# EAGLE design Interface (EAGLE 7.6.0)

## Sheet 1 of 3
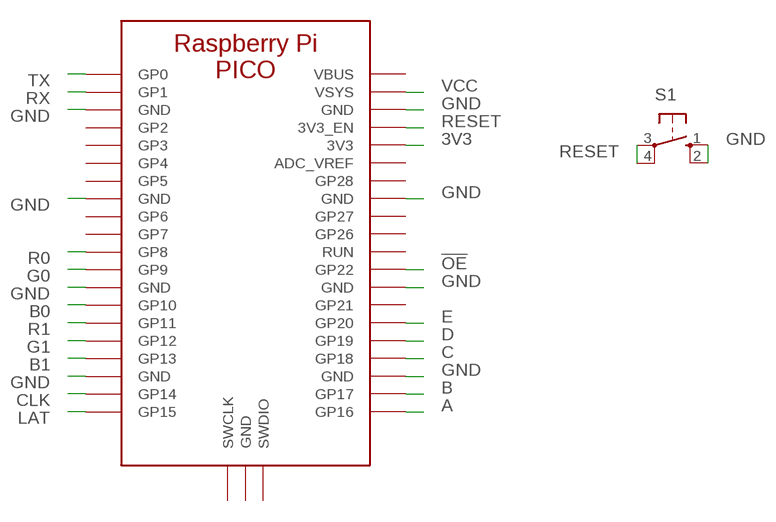
[diagram p0: schematic, sheet 1]

### Parts
S1  10-XX  [B3F-10XX]
U$1  PICO  [PICO]

### Nets
3V3: U$1.P$3V3(3V3) ; also sheet 2
!OE: U$1.P$GP22(GP22) ; also sheet 3
A: U$1.P$GP16(GP16) ; also sheet 3
B: U$1.P$GP17(GP17) ; also sheet 3
B0: U$1.P$GP10(GP10) ; also sheet 3
B1: U$1.P$GP13(GP13) ; also sheet 3
C: U$1.P$GP18(GP18) ; also sheet 3
CLK: U$1.P$GP14(GP14) ; also sheet 3
D: U$1.P$GP19(GP19) ; also sheet 3
E: U$1.P$GP20(GP20) ; also sheet 3
G0: U$1.P$GP9(GP9) ; also sheet 3
G1: U$1.P$GP12(GP12) ; also sheet 3
GND: S1.1(S) S1.2(S1) U$1.P$GND3(GND) U$1.P$GND8(GND) U$1.P$GND13(GND) U$1.P$GND18(GND) U$1.P$GND23(GND) U$1.P$GND28(GND) U$1.P$GND33(GND) U$1.P$GND38(GND) ; also sheet 2,3
LAT: U$1.P$GP15(GP15) ; also sheet 3
R0: U$1.P$GP8(GP8) ; also sheet 3
R1: U$1.P$GP11(GP11) ; also sheet 3
RESET: S1.3(P) S1.4(P1) U$1.P$3V3_EN(3V3_EN)
RX: U$1.P$GP1(GP1) ; also sheet 2
TX: U$1.P$GP0(GP0) ; also sheet 2
VCC: U$1.P$VSYNC(VSYS) ; also sheet 2
Unconnected: U$1.P$GP2(GP2) U$1.P$GP3(GP3) U$1.P$GP4(GP4) U$1.P$GP5(GP5) U$1.P$GP6(GP6) U$1.P$GP7(GP7) U$1.P$GP21(GP21) U$1.P$GP26(GP26) U$1.P$GP27(GP27) U$1.P$GP28(GP28) U$1.P$RUN(RUN) U$1.P$SWCLK(SWCLK) U$1.P$SWDIO(SWDIO)

## Sheet 2 of 3
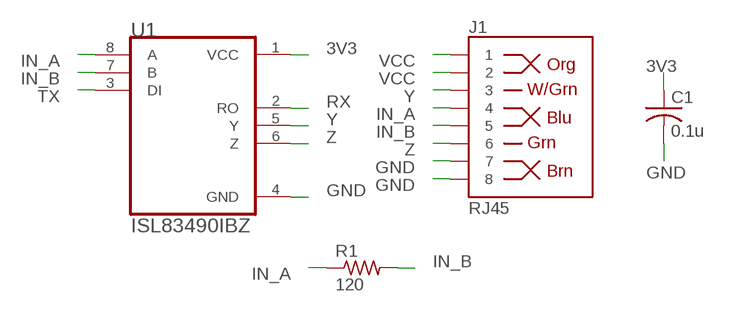
[diagram p1: schematic, sheet 2]

### Parts
C1  0.1u  C-USC0603  [C0603]
J1  RJ45  RJ45-8PTH  [RJ45-8]
R1  120  R-US_R0603  [R0603]
U1  ISL83490IBZ  [SOIC127P600X175-8N]

### Nets
3V3: C1.1 U1.1(VCC) ; also sheet 1
GND: C1.2 J1.7 J1.8 U1.4(GND) ; also sheet 1,3
IN_A: J1.4 R1.1 U1.8(A)
IN_B: J1.5 R1.2 U1.7(B)
RX: U1.2(RO) ; also sheet 1
TX: U1.3(DI) ; also sheet 1
VCC: J1.1 J1.2 ; also sheet 1
Y: J1.3 U1.5(Y)
Z: J1.6 U1.6(Z)

## Sheet 3 of 3
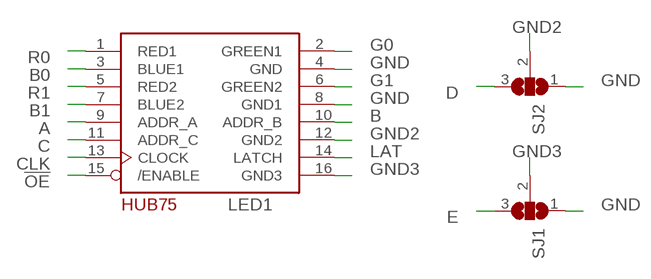
[diagram p2: schematic, sheet 3]

### Parts
LED1  HUB75MATRIX  [2X08-IDC]
SJ1  SJ2W  [SJ_2]
SJ2  SJ2W  [SJ_2]

### Nets
!OE: LED1.15(/ENABLE) ; also sheet 1
A: LED1.9(ADDR_A) ; also sheet 1
B: LED1.10(ADDR_B) ; also sheet 1
B0: LED1.3(BLUE1) ; also sheet 1
B1: LED1.7(BLUE2) ; also sheet 1
C: LED1.11(ADDR_C) ; also sheet 1
CLK: LED1.13(CLOCK) ; also sheet 1
D: SJ2.3 ; also sheet 1
E: SJ1.3 ; also sheet 1
G0: LED1.2(GREEN1) ; also sheet 1
G1: LED1.6(GREEN2) ; also sheet 1
GND: LED1.4(GND) LED1.8(GND1) SJ1.1 SJ2.1 ; also sheet 1,2
GND2: LED1.12(GND2) SJ2.2
GND3: LED1.16(GND3) SJ1.2
LAT: LED1.14(LATCH) ; also sheet 1
R0: LED1.1(RED1) ; also sheet 1
R1: LED1.5(RED2) ; also sheet 1

## Power pins joined to a net without a drawn wire
ADC_VREF: U$1.P$ADC_VREF(ADC_VREF)
GND: U$1.P$GND(GND)
VBUS: U$1.P$VBUS(VBUS)

## Library data of the parts
C1 = rcl:C-US: CAPACITOR, American symbol
J1 = SparkFun-Connectors:RJ45-8: RJ45 Jack Simple RJ45, 8-pin connection - connector for common Cat5, Cat5e, and Cat6 Ethernet cables. Footprint not yet proven in production. Connector sku is PRT-00643; Breakout PCB sku is BOB-00716.; PROD_ID: CONN-08506
LED1 = adafruit:HUB75MATRIX
R1 = rcl:R-US_: RESISTOR, American symbol
S1 = switch-omron:10-XX: OMRON SWITCH; MPN: B3F-1000; OC_FARNELL: 176432; OC_NEWARK: 36M3542
SJ1 SJ2 = jumper:SJ2W: SMD solder JUMPER
U1 = ISL83490IBZ:ISL83490IBZ: None; DESCRIPTION: ISL83490 Series 3.6 V 10 Mbps Low Power High Speed RS-485/RS-422 Transceiver; DIGI-KEY_PART_NUMBER: ISL83490IBZ-TCT-ND; DIGI-KEY_PURCHASE_URL: https://www.digikey.com/product-detail/en/renesas-electronics-america-inc/ISL83490IBZ-T/ISL83490IBZ-TCT-ND/3603227?utm_source=snapeda&utm_medium=aggregator&utm_campaign=symbol; MF: Renesas Electronics; MP: ISL83490IBZ-T; PACKAGE: SOIC-8 Intersil
U$1 = Raspberry_Pi_Pico:PICO

## Board
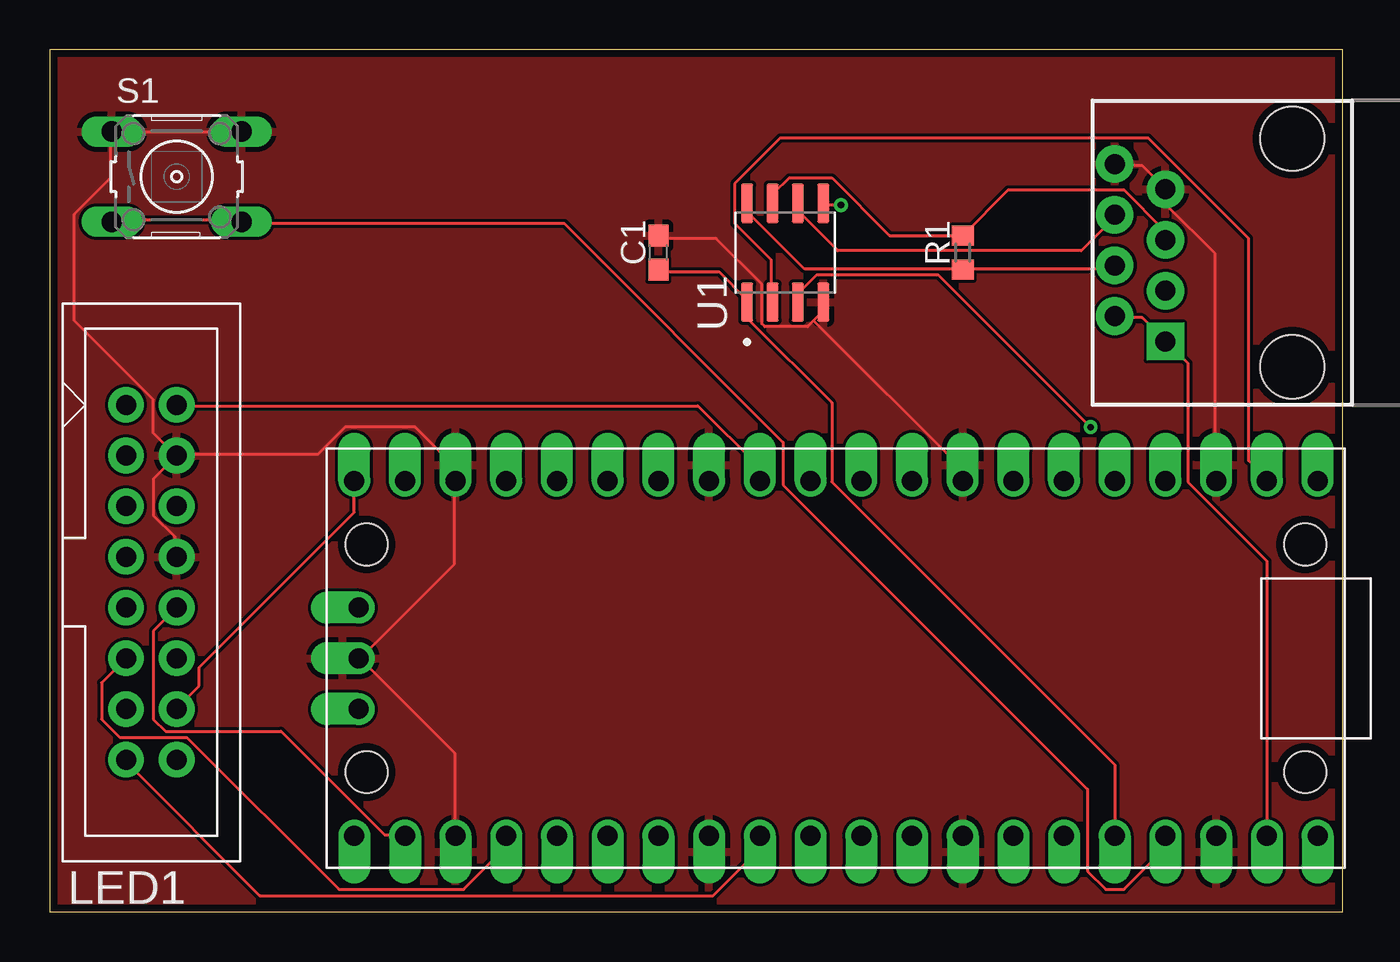
[diagram p3: board, top side]
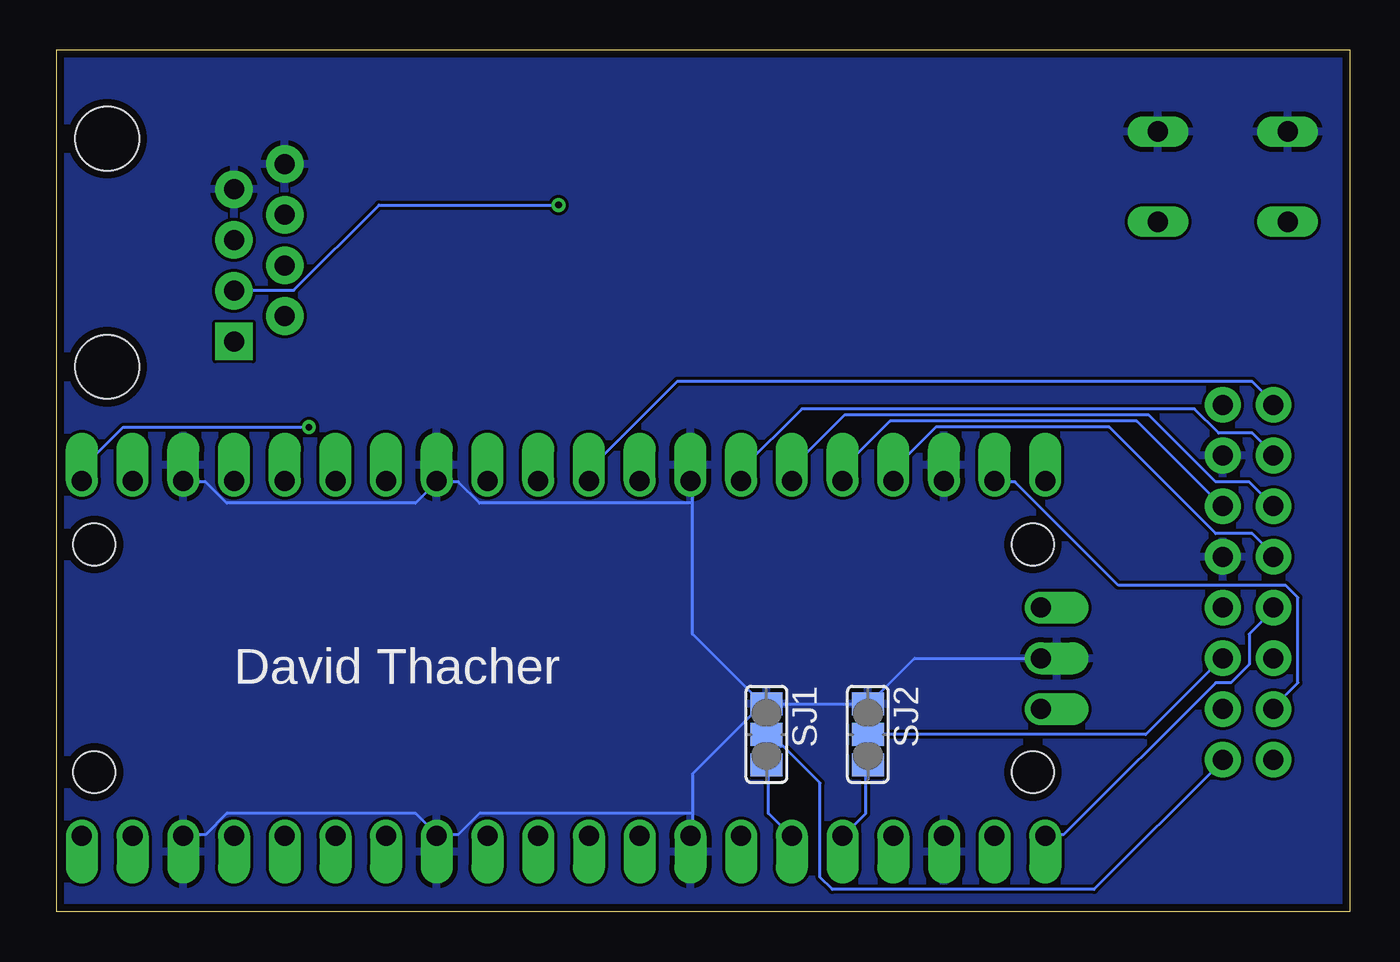
[diagram p4: board, bottom side, seen from below]

Size 64.77 x 43.18 mm. Coordinates in mm from the lower left corner, seen from the top.
Outline: 0,0 64.77,0 64.77,43.18 0,43.18 0,0
Copper layers (1*16): Top 0.0356mm / dielectric 1.5011mm / Bottom 0.0356mm
Design rules "oshpark-2layer": minimum track width 6mil, minimum drill 13mil, track to track 6mil, track to pad 6mil, pad to pad 6mil, via to via 6mil, smd to smd 6mil, copper to edge 15mil, drill to drill 6mil, minimum pad ring 7mil, minimum via ring 7mil, stop-mask expansion 2.5mil, vias tented up to drill 0mil, thermal gap 10mil

### Footprints (pad centres in the part's own frame; a part is rotated, then mirrored left to right if it is on the bottom)
C0603 = smd 1.1 x 1: 1 -0.85,0; 2 0.85,0
RJ45-8 = drill 1 pad 1.88 square: 1 -4.445,6.35 | drill 1 pad 1.88: 2 -3.175,8.89; 3 -1.905,6.35; 4 -0.635,8.89; 5 0.635,6.35; 6 1.905,8.89; 7 3.175,6.35; 8 4.445,8.89 | hole 3.2: -5.715,0; 5.715,0
2X08-IDC = drill 1 pad 1.778: 1 -1.27,8.89; 2 1.27,8.89; 3 -1.27,6.35; 4 1.27,6.35; 5 -1.27,3.81; 6 1.27,3.81; 7 -1.27,1.27; 8 1.27,1.27; 9 -1.27,-1.27; 10 1.27,-1.27; 11 -1.27,-3.81; 12 1.27,-3.81; 13 -1.27,-6.35; 14 1.27,-6.35; 15 -1.27,-8.89; 16 1.27,-8.89
R0603 = smd 1 x 1.1: 1 -0.85,0; 2 0.85,0
B3F-10XX = drill 1.016 long: 1 -3.251,2.261; 2 3.251,2.261; 3 -3.251,-2.261; 4 3.251,-2.261
SJ_2 = smd 1.168 x 1.6: 1 -1.524,0; 2 0,0; 3 1.524,0
SOIC127P600X175-8N = smd 1.97 x 0.6: 1 -2.475,1.905; 2 -2.475,0.635; 3 -2.475,-0.635; 4 -2.475,-1.905; 5 2.475,-1.905; 6 2.475,-0.635; 7 2.475,0.635; 8 2.475,1.905
PICO = drill 1 pad 1.6 offset: P$3V3 8.89,13.97; P$3V3_EN 8.89,16.51; P$ADC_VREF 8.89,11.43; P$GND 0,-23.9; P$GND3 -8.89,19.05; P$GND8 -8.89,6.35; P$GND13 -8.89,-6.35; P$GND18 -8.89,-19.05; P$GND23 8.89,-19.05; P$GND28 8.89,-6.35; P$GND33 8.89,6.35; P$GND38 8.89,19.05; P$GP0 -8.89,24.13; P$GP1 -8.89,21.59; P$GP2 -8.89,16.51; P$GP3 -8.89,13.97; P$GP4 -8.89,11.43; P$GP5 -8.89,8.89; P$GP6 -8.89,3.81; P$GP7 -8.89,1.27; P$GP8 -8.89,-1.27; P$GP9 -8.89,-3.81; P$GP10 -8.89,-8.89; P$GP11 -8.89,-11.43; P$GP12 -8.89,-13.97; P$GP13 -8.89,-16.51; P$GP14 -8.89,-21.59; P$GP15 -8.89,-24.13; P$GP16 8.89,-24.13; P$GP17 8.89,-21.59; P$GP18 8.89,-16.51; P$GP19 8.89,-13.97; P$GP20 8.89,-11.43; P$GP21 8.89,-8.89; P$GP22 8.89,-3.81; P$GP26 8.89,1.27; P$GP27 8.89,3.81; P$GP28 8.89,8.89; P$RUN 8.89,-1.27; P$SWCLK -2.54,-23.9; P$SWDIO 2.54,-23.9; P$VBUS 8.89,24.13; P$VSYNC 8.89,21.59 | hole 2.1: -5.7,-23.5; 5.7,-23.5; 5.7,23.5; -5.7,23.5

### Placement (x,y rotation side)
C1  30.48,33.02 90 top
J1  62.23,33.02 90 top
LED1  5.08,16.51 0 top
R1  45.72,33.02 90 top
S1  6.35,36.83 0 top
SJ1  29.21,8.89 270 bottom
SJ2  24.13,8.89 270 bottom
U1  36.83,33.02 90 top
U$1  39.37,12.7 270 top

### Tracks (layer width: path | path; a pad name or v marks a point on that pad's centre or on a via)
3V3
  Top 0.152: C1.1 30.48,32.05 33.53,32.05 34.9,30.68 U1.1 35.05,30.53 35.05,29.62 39.17,25.5 39.17,21.54 53.34,7.37 U$1.P$3V3
!OE
  Top 0.152: U$1.P$GP22 35.51,3.71 35.51,3.1 33.22,0.81 10.52,0.81 3.81,7.52 LED1.15
A
  Bottom 0.152: U$1.P$GP16 15.24,3.86 14.33,3.86 6.71,11.48 5.94,11.48 5.03,12.39 5.03,13.92 3.81,15.14 LED1.9
B
  Top 0.152: LED1.10 5.18,14.07 5.18,9.65 5.79,9.04 11.58,9.04 16.76,3.86 17.68,3.86 U$1.P$GP17
B0
  Bottom 0.152: U$1.P$GP10 30.48,22.15 27.43,25.2 7.77,25.2 6.55,23.98 4.88,23.98 3.81,22.91 LED1.3
B1
  Bottom 0.152: U$1.P$GP13 22.86,22.15 20.73,24.28 12.04,24.28 6.71,18.95 4.88,18.95 3.81,17.88 LED1.7
C
  Top 0.152: U$1.P$GP18 22.86,3.25 20.73,1.12 14.48,1.12 6.86,8.74 3.5,8.74 2.59,9.65 2.59,11.48 LED1.11
CLK
  Bottom 0.152: U$1.P$GP14 17.68,21.54 16.76,21.54 11.58,16.36 3.2,16.36 2.59,15.75 2.59,11.48 3.81,10.26 LED1.13
D
  Bottom 0.152: SJ2.3 24.23,7.37 24.23,4.93 25.3,3.86 U$1.P$GP19
E
  Bottom 0.152: SJ1.3 29.11,7.37 29.11,4.93 28.04,3.86 U$1.P$GP20
G0
  Top 0.152: U$1.P$GP9 35.51,21.69 35.51,22.3 32.46,25.35 6.4,25.35 LED1.2
G1
  Bottom 0.152: U$1.P$GP12 25.3,21.69 25.3,22.3 23.01,24.59 10.67,24.59 6.4,20.32 LED1.6
GND
  Top 0.152: J1.8 53.34,37.39 54.71,37.39 55.78,36.32 J1.7 55.93,36.17 55.93,35.41 58.37,32.97 58.37,21.69 U$1.P$GND3 | 38.25,29.62 38.71,30.07 38.71,30.53 U1.4 | 38.25,29.62 37.95,29.31 35.81,29.31 35.66,29.46 35.66,31.45 33.38,33.73 30.48,33.73 C1.2 | U$1.P$GND8 45.72,22.15 38.25,29.62 | S1.2 9.6,39.06 3.2,39.06 S1.1 3.05,39.06 3.05,36.78 1.22,34.95 1.22,29.62 5.18,25.65 5.18,23.98 6.25,22.91 LED1.4 | LED1.4 5.18,21.69 5.18,19.86 6.25,18.8 6.25,17.88 LED1.8 | 15.54,12.7 20.27,7.98 20.27,3.86 U$1.P$GND23 | 15.54,12.7 20.27,17.42 20.27,21.54 U$1.P$GND18 20.27,21.69 20.27,22.3 18.29,24.28 14.78,24.28 13.41,22.91 6.4,22.91 LED1.4 | 15.54,12.7 U$1.P$GND
  Bottom 0.152: 45.72,21.54 46.79,20.47 56.24,20.47 57.3,21.54 58.37,21.54 U$1.P$GND3 | SJ1.1 SJ2.1 24.08,10.41 21.79,12.7 U$1.P$GND | 32.92,4.93 32.92,6.91 29.41,10.41 | 32.92,4.93 32.92,3.86 U$1.P$GND28 | SJ1.1 29.41,10.41 | 32.92,20.47 32.92,13.92 29.41,10.41 | 32.92,20.47 32.92,21.54 U$1.P$GND13 | 29.26,10.41 SJ1.1 | 45.72,3.86 44.65,3.86 43.59,4.93 32.92,4.93 | 45.72,3.86 46.79,4.93 56.24,4.93 57.3,3.86 58.37,3.86 U$1.P$GND38 | 45.72,3.86 U$1.P$GND33 | 45.72,21.54 44.65,21.54 43.59,20.47 32.92,20.47 | 45.72,21.54 U$1.P$GND8
  pour Bottom: 0,43.18 64.77,43.18 64.77,0 0,0
  pour Top: 0,43.18 64.77,43.18 64.77,0 0,0
GND2
  Bottom 0.152: SJ2.2 10.21,8.89 6.4,12.7 LED1.12
GND3
  Bottom 0.152: SJ1.2 29.11,8.89 28.5,8.28 28.35,8.28 26.52,6.45 26.52,1.73 25.91,1.12 12.8,1.12 6.4,7.52 LED1.16
IN_A
  Top 0.152: 45.72,32.21 53.19,32.21 53.34,32.36 J1.4 | 45.72,32.21 37.8,32.21 35.05,34.95 35.05,35.41 U1.8 | 45.72,32.21 R1.1
IN_B
  Top 0.152: 45.72,33.88 42.06,33.88 39.17,36.78 37.03,36.78 36.27,36.02 36.27,35.56 U1.7 | 45.72,33.88 48.01,36.17 53.8,36.17 55.78,34.19 55.78,33.73 J1.5 | 45.72,33.88 R1.2
LAT
  Top 0.152: U$1.P$GP15 15.24,20.02 7.47,12.24 7.47,11.33 6.4,10.26 LED1.14
R0
  Bottom 0.152: U$1.P$GP8 38.1,22.15 33.68,26.57 4.88,26.57 3.81,25.5 LED1.1
R1
  Bottom 0.152: LED1.5 5.03,21.54 6.71,21.54 10.06,24.89 25.3,24.89 27.89,22.3 27.89,21.69 U$1.P$GP11
RESET
  Top 0.152: S1.3 3.2,34.65 9.6,34.65 S1.4 9.6,34.49 25.76,34.49 36.73,23.52 36.73,21.39 51.97,6.15 51.97,2.03 52.88,1.12 53.8,1.12 55.78,3.1 55.78,3.71 U$1.P$3V3_EN
RX
  Top 0.152: U1.2 36.12,30.68 36.12,32.66 34.29,34.49 34.29,36.47 36.58,38.76 55.02,38.76 60.05,33.73 60.05,22.61 60.96,21.69 U$1.P$GP1
TX  (via drill 0.33)
  Top 0.152: v52.12,24.28 44.5,31.9 38.41,31.9 37.49,30.99 37.49,30.68 U1.3
  Bottom 0.152: v52.12,24.28 61.42,24.28 63.4,22.3 63.4,21.69 U$1.P$GP0
VCC
  Top 0.152: U$1.P$VSYNC 60.96,17.58 57,21.54 57,27.48 55.93,28.55 J1.1 55.78,28.7 54.71,29.77 53.34,29.77 J1.2
Y  (via drill 0.33)
  Top 0.152: v39.62,35.41 38.86,35.41 U1.5
  Bottom 0.152: v39.62,35.41 48.62,35.41 52.88,31.14 55.78,31.14 J1.3
Z
  Top 0.152: U1.6 37.49,35.41 37.49,35.1 39.47,33.12 51.66,33.12 53.34,34.8 J1.6

### Text on the board
bNames: David Thacher